# Altium schematic sheet BW1097_HUB.SchDoc: =project_title (part 3 of 3)
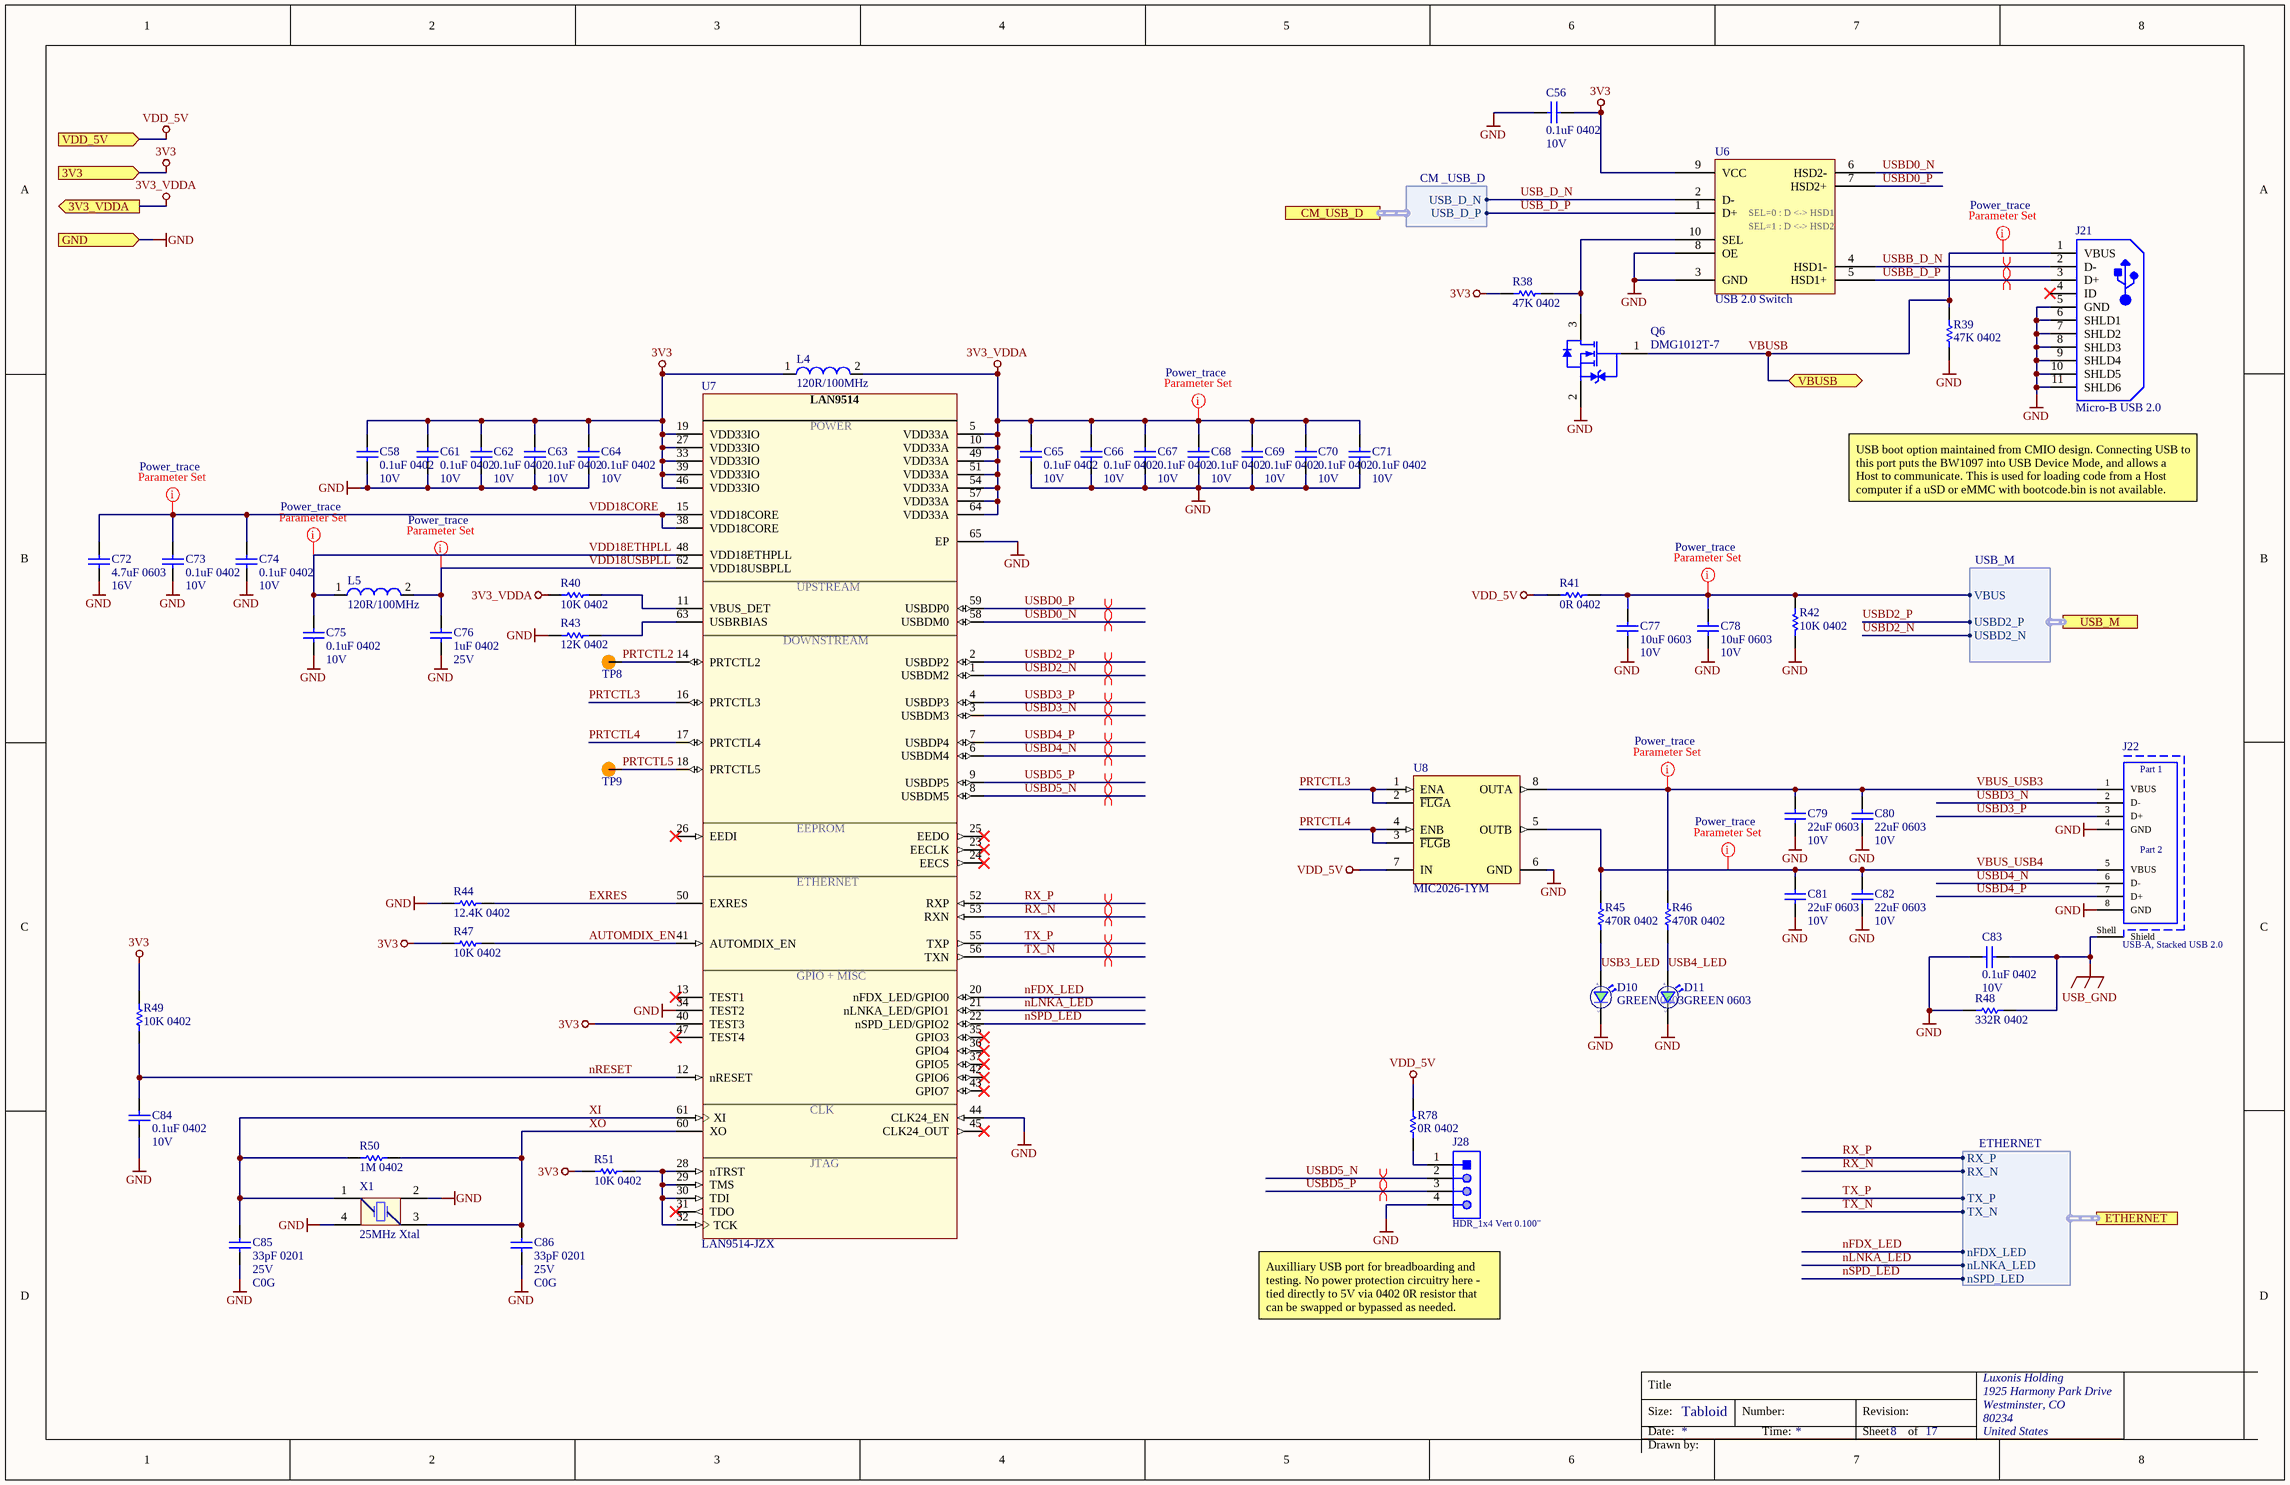
[diagram p2: BW1097_HUB.SchDoc]

## Library data of the parts (continued)
X1 = 8Z-25.000MAAJ-T: CRYSTAL 25.0000MHZ 18PF SMD; Manufacturer 1: TXC; Frequency Tolerance: 30ppm; ESR (Equivalent Series Resistance): 100R; Manufacturer Part Number 1: 8Z-25.000MAAJ-T; Supplier 1: Digi-Key; Stock 1: 7343; Pricing 1: 1=1.36000, 10=1.30100, 50=1.27060, 100=1.08900, 500=1.05876, 1000=0.89238 (USD); RoHS: Yes; Mount: Surface Mount; Case/Package: SMD/SMT; Number of Pins: 4; Min Operating Temperature: -10°C; Max Operating Temperature: 70°C; Frequency: 25MHz; Load Capacitance: 18pF; Packaging: Tape and Reel; Package Quantity: 3000; Tolerance: 30ppm; Frequency Stability: 30ppm; Termination: SMD/SMT; Length: 2.5mm; Height: 0.022inch; Width: 2mm; Depth: 2.05mm; REACH SVHC: No SVHC; Lead Free: Lead Free; ComponentLink1URL: https://datasheet.ciiva.com/26833/getdatasheetpartid-743023-26833236.pdf?src-supplier=Verical; ComponentLink1Description: https://datasheet.ciiva.com/26833/getdatasheetpartid-743023-26833236.pdf?src-supplier=Verical; ComponentLink2URL: https://datasheet.ciiva.com/22698/1041872-22698773.pdf?src-supplier=Element14; ComponentLink2Description: https://datasheet.ciiva.com/22698/1041872-22698773.pdf?src-supplier=Element14; ComponentLink3URL: https://datasheet.ciiva.com/1356/number-crystal-basic-1356678.pdf?src-supplier=Element14; ComponentLink3Description: https://datasheet.ciiva.com/1356/number-crystal-basic-1356678.pdf?src-supplier=Element14; ComponentLink4URL: https://datasheet.ciiva.com/859/8z-859017.pdf?src-supplier=Digi-Key; ComponentLink4Description: https://datasheet.ciiva.com/859/8z-859017.pdf?src-supplier=Digi-Key; ComponentLink5URL: https://datasheet.ciiva.com/859/8z-859018.pdf?src-supplier=Digi-Key; ComponentLink5Description: https://datasheet.ciiva.com/859/8z-859018.pdf?src-supplier=Digi-Key; ComponentLink6URL: https://datasheet.ciiva.com/859/8z-859019.pdf?src-supplier=Digi-Key; ComponentLink6Description: https://datasheet.ciiva.com/859/8z-859019.pdf?src-supplier=Digi-Key; Supplier 2: Mouser; Supplier Part Number 1: 887-1145-1-ND; Supplier Part Number 2: 717-8Z-25.000MAAJ-T